# EAGLE design untitled (EAGLE 5.04)
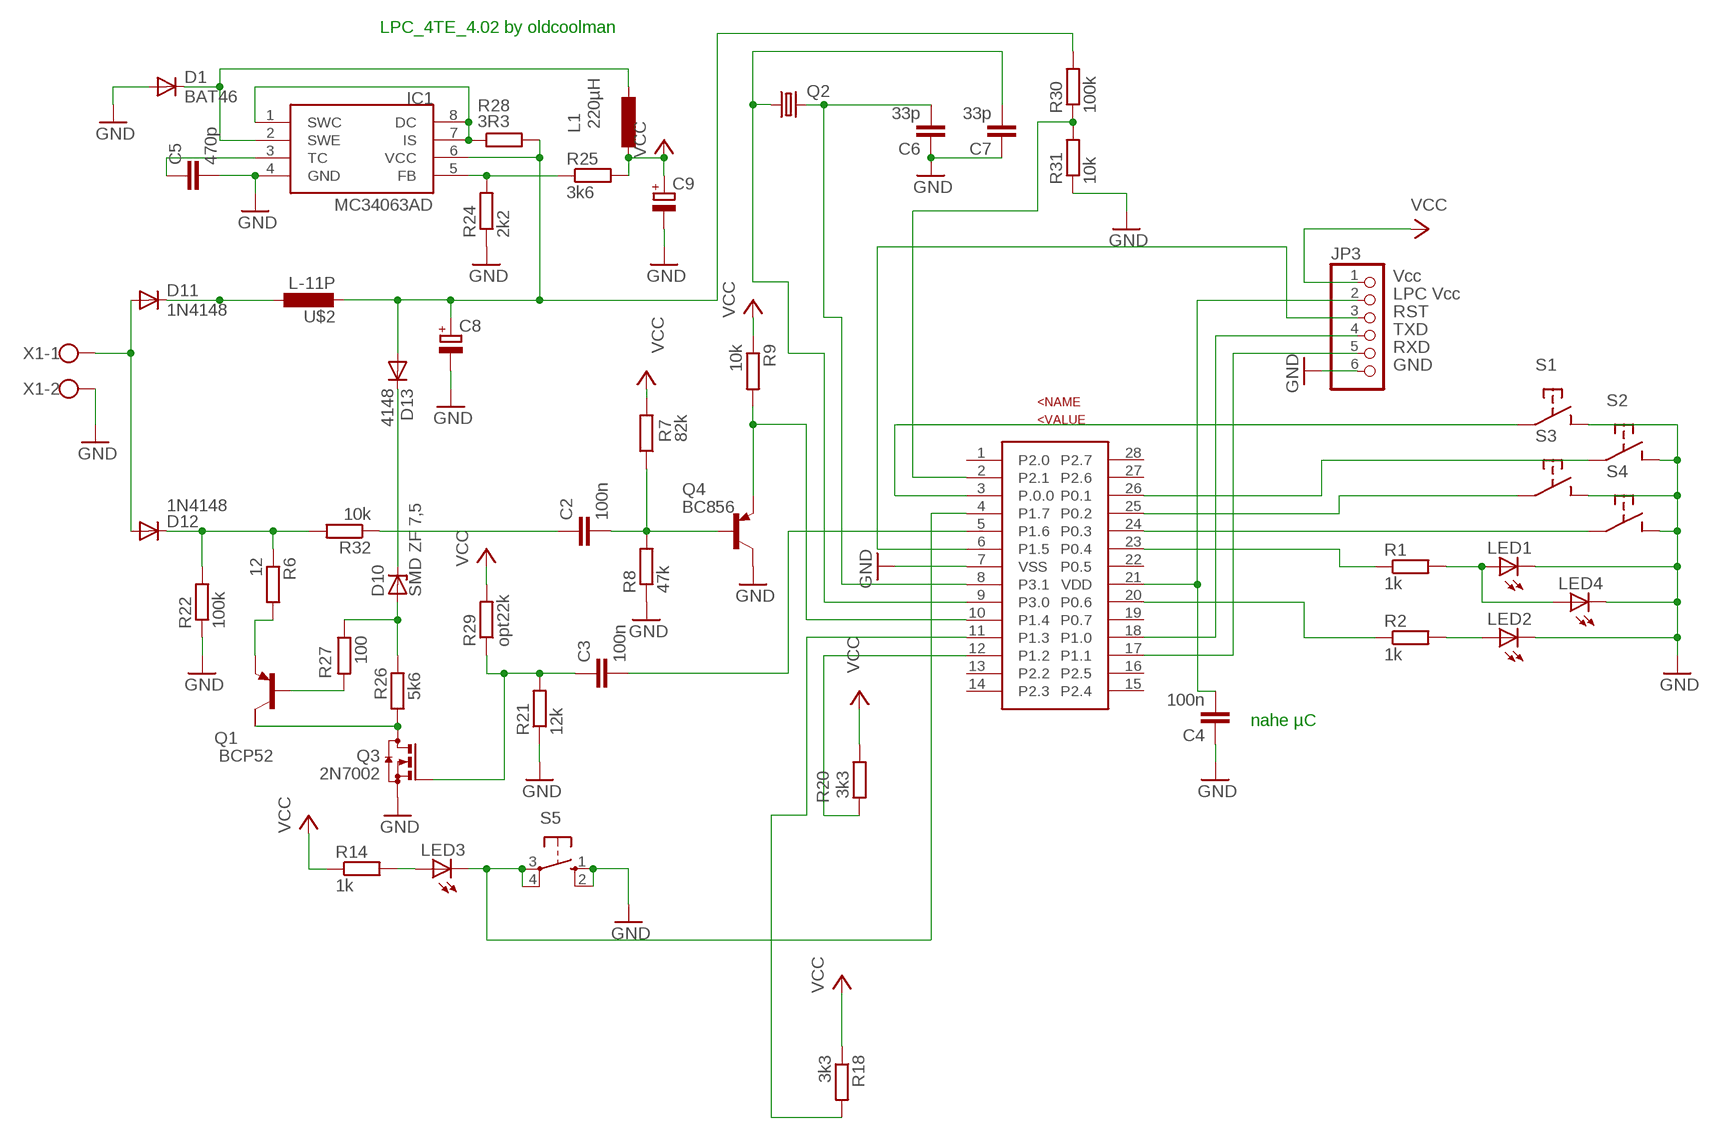
[diagram p0: schematic, sheet 1]

## Parts
C2  100n  C-EUC1206  [C1206]
C3  100n  C-EUC1206  [C1206]
C4  100n  C-EUC1206  [C1206]
C5  470p  C-EUC1206  [C1206]
C6  33p  C-EUC1206  [C1206]
C7  33p  C-EUC1206  [C1206]
C8  CPOL-EUE3.5-8  [E3,5-8]
C9  CPOL-EUE2.5-5  [E2,5-5]
D1  BAT46  DIODE-MINIMELF  [MINIMELF]
D10  SMD ZF 7,5  ZPD  [MINIMELF]
D11  1N4148  DIODE-MINIMELF  [MINIMELF]
D12  1N4148  DIODE-MINIMELF  [MINIMELF]
D13  4148  DIODE-MINIMELF  [MINIMELF]
IC1  MC34063AD  [SOIC8]
JP3  PINHD-1X6  [1X06]
L1  220µH  L-EU2200-11.43  [2200-11.43]
LED1  LED3MM  [LED3MM]
LED2  LED3MM  [LED3MM]
LED3  LED3MM  [LED3MM]
LED4  LED3MM  [LED3MM]
Q1  BCP52  FZT753SMD  [SOT223]
Q2  CRYSTALHC49U-V  [HC49U-V]
Q3  2N7002  BSS123  [SOT23]
Q4  BC856  BC856ALT1SMD  [SOT23-BEC]
R1  1k  R-EU_R1206  [R1206]
R2  1k  R-EU_R1206  [R1206]
R6  12  R-EU_R1206  [R1206]
R7  82k  R-EU_R1206  [R1206]
R8  47k  R-EU_M1206  [M1206]
R9  10k  R-EU_R1206  [R1206]
R14  1k  R-EU_R1206  [R1206]
R18  3k3  R-EU_R1206  [R1206]
R20  3k3  R-EU_M1206  [M1206]
R21  12k  R-EU_R1206  [R1206]
R22  100k  R-EU_M1206  [M1206]
R24  2k2  R-EU_R1206  [R1206]
R25  3k6  R-EU_M1206  [M1206]
R26  5k6  R-EU_M1206  [M1206]
R27  100  R-EU_R1206  [R1206]
R28  3R3  R-EU_M1206  [M1206]
R29  opt22k  R-EU_R1206  [R1206]
R30  100k  R-EU_R1206  [R1206]
R31  10k  R-EU_R1206  [R1206]
R32  10k  R-EU_R1206  [R1206]
S1  3305  [3305]
S2  3305  [3305]
S3  3305  [3305]
S4  3305  [3305]
S5  10-XX  [B3F-10XX]
U$1  LPC936TSSOP28  [TSSOP28]
U$2  L-11P  [11P]
X1  W237-02P  [W237-132]

## Nets
EIB+: D11.A D12.A X1.1
GND: C4.1 C5.2 C6.1 C7.1 C8.- C9.- D1.A IC1.4(GND) JP3.6 LED1.K(C) LED2.K(C) LED4.K(C) Q3.2(S) Q4.C R8.1 R21.1 R22.1 R24.1 R31.1 S1.P$2 S2.P$2 S3.P$2 S4.P$2 S5.1(S) S5.2(S1) U$1.7(VSS) X1.2
N$1: LED1.A LED4.A R1.2
N$2: LED2.A R2.2
N$7: LED3.K(C) S5.3(P) S5.4(P1) U$1.4(P1.7)
N$9: LED3.A R14.2
N$30: Q4.E R9.2 U$1.10(P1.4)
N$31: C2.2 Q4.B R7.1 R8.2
N$33: C3.2 U$1.5(P1.6)
N$34: D12.C R6.1 R22.2 R32.2
N$41: JP3.5 U$1.17(P1.1)
N$42: JP3.3 U$1.6(P1.5)
N$43: JP3.4 U$1.18(P1.0)
N$44: C4.2 JP3.2 U$1.21(VDD)
N$47: R18.2 U$1.11(P1.3)
N$48: C3.1 Q3.1(G) R21.2 R29.1
N$50: IC1.5(FB) R24.2 R25.1
N$51: D1.C IC1.2(SWE) L1.2
N$52: C5.1 IC1.3(TC)
N$53: D11.C U$2.P$1
N$54: Q1.2(C) Q3.3(D) R26.1
N$55: D10.A R26.2 R27.1
N$56: Q1.3(E) R6.2
N$57: Q1.1(B) R27.2
N$58: D10.C D13.C
N$59: C6.2 Q2.2 U$1.8(P3.1)
N$63: IC1.1(SWC) IC1.7(IS) IC1.8(DC) R28.1
N$71: R20.2 U$1.12(P1.2)
N$72: C8.+ D13.A IC1.6(VCC) R28.2 R30.2 U$2.P$2
N$75: R30.1 R31.2 U$1.2(P2.1)
N$76: C7.2 Q2.1 U$1.9(P3.0)
N$77: C2.1 R32.1
P0.0: S1.P$1 U$1.3(P.0.0)
P0.1: S2.P$1 U$1.26(P0.1)
P0.2: S3.P$1 U$1.25(P0.2)
P0.3: S4.P$1 U$1.24(P0.3)
P0.4: R1.1 U$1.23(P0.4)
P0.6: R2.1 U$1.20(P0.6)
VCC: C9.+ JP3.1 L1.1 R7.2 R9.1 R14.1 R18.1 R20.1 R25.2 R29.2
Unconnected: Q1.4(C/) U$1.1(P2.0) U$1.13(P2.2) U$1.14(P2.3) U$1.15(P2.4) U$1.16(P2.5) U$1.19(P0.7) U$1.22(P0.5) U$1.27(P2.6) U$1.28(P2.7)

## Notes on the sheet
- LPC_4TE_4.02 by oldcoolman
- Vcc
- LPC Vcc
- RST
- TXD
- RXD
- GND
- nahe µC

## Library data of the parts
C2-C7 = rcl:C-EU: CAPACITOR, European symbol
C8 C9 = rcl:CPOL-EU: POLARIZED CAPACITOR, European symbol
D1 D11-D13 = diode:DIODE-: DIODE
D10 = diode:ZPD: Z DIODE 500 mW
IC1 = mc34063:MC34063
JP3 = pinhead:PINHD-1X6: PIN HEADER
L1 = rcl:L-EU: INDUCTOR, European symbol
LED1-LED4 = led:LED: LED OSRAM: - CHIPLED LG R971, LG N971, LY N971, LG Q971, LY Q971, LO R971, LY R971 LH N974, LH R974 LS Q976, LO Q976, LY Q976 LO Q996 - Hyper CHIPLED LW Q18S LB Q993, LB Q99A, LB R99A - SideLED LS A670, LO A670, LY A670, LG A670, LP A670 LB A673, LV A673, LT A673, LW A673 LH A674 LY A675 LS A676, LA A676, LO A676, LY A676, LW A676 LS A679, LY A679, LG A679 - Hyper Micro SIDELED® LS Y876, LA Y876, LO Y876, LY Y876 LT Y87S - SmartLED LW L88C, LW L88S LB L89C, LB L89S, LG L890 LS L89K, LO L89K, LY L89K LS L896, LA L896, LO L896, LY L896 - TOPLED LS T670, LO T670, LY T670, LG T670, LP T670 LSG T670, LSP T670, LSY T670, LOP T670, LYG T670 LG T671, LOG T671, LSG T671 LB T673, LV T673, LT T673, LW T673 LH T674 LS T676, LA T676, LO T676, LY T676, LB T676, LH T676, LSB T676, LW T676 LB T67C, LV T67C, LT T67C, LS T67K, LO T67K, LY T67K, LW E67C LS E67B, LA E67B, LO E67B, LY E67B, LB E67C, LV E67C, LT E67C LW T67C LS T679, LY T679, LG T679 LS T770, LO T770, LY T770, LG T770, LP T770 LB T773, LV T773, LT T773, LW T773 LH T774 LS E675, LA E675, LY E675, LS T675 LS T776, LA T776, LO T776, LY T776, LB T776 LHGB T686 LT T68C, LB T68C - Hyper Mini TOPLED® LB M676 - Mini TOPLED Santana® LG M470 LS M47K, LO M47K, LY M47K Source: http://www.osram.convergy.de - LUMILED® LXK2-PW12-R00, LXK2-PW12-S00, LXK2-PW14-U00, LXK2-PW14-V00 LXK2-PM12-R00, LXK2-PM12-S00, LXK2-PM14-U00 LXK2-PE12-Q00, LXK2-PE12-R00, LXK2-PE12-S00, LXK2-PE14-T00, LXK2-PE14-U00 LXK2-PB12-K00, LXK2-PB12-L00, LXK2-PB12-M00, LXK2-PB14-N00, LXK2-PB14-P00, LXK2-PB14-Q00 LXK2-PR12-L00, LXK2-PR12-M00, LXK2-PR14-Q00, LXK2-PR14-R00 LXK2-PD12-Q00, LXK2-PD12-R00, LXK2-PD12-S00 LXK2-PH12-R00, LXK2-PH12-S00 LXK2-PL12-P00, LXK2-PL12-Q00, LXK2-PL12-R00 Source: www.luxeon.com
Q1 = transistor-pnp:FZT753SMD: PNP Transistor
Q2 = crystal:CRYSTAL: CRYSTAL
Q3 = transistor-small-signal:BSS123: N-CHANNEL MOS FET
Q4 = transistor-pnp:BC856*: PNP Transistror
R1 R2 R6-R9 R14 R18 R20-R22 R24-R32 = rcl:R-EU_: RESISTOR, European symbol
S1-S4 = kubi:3305: Taster 3305
S5 = switch-omron:10-XX: OMRON SWITCH
U$1 = freebuslpc:LPC936: C51 Based Microcontroller LPC936 ADC and 16kbyte Flash
U$2 = rcl:L-11P
X1 = con-wago-508:W237-02P: WAGO SREW CLAMP

## Board
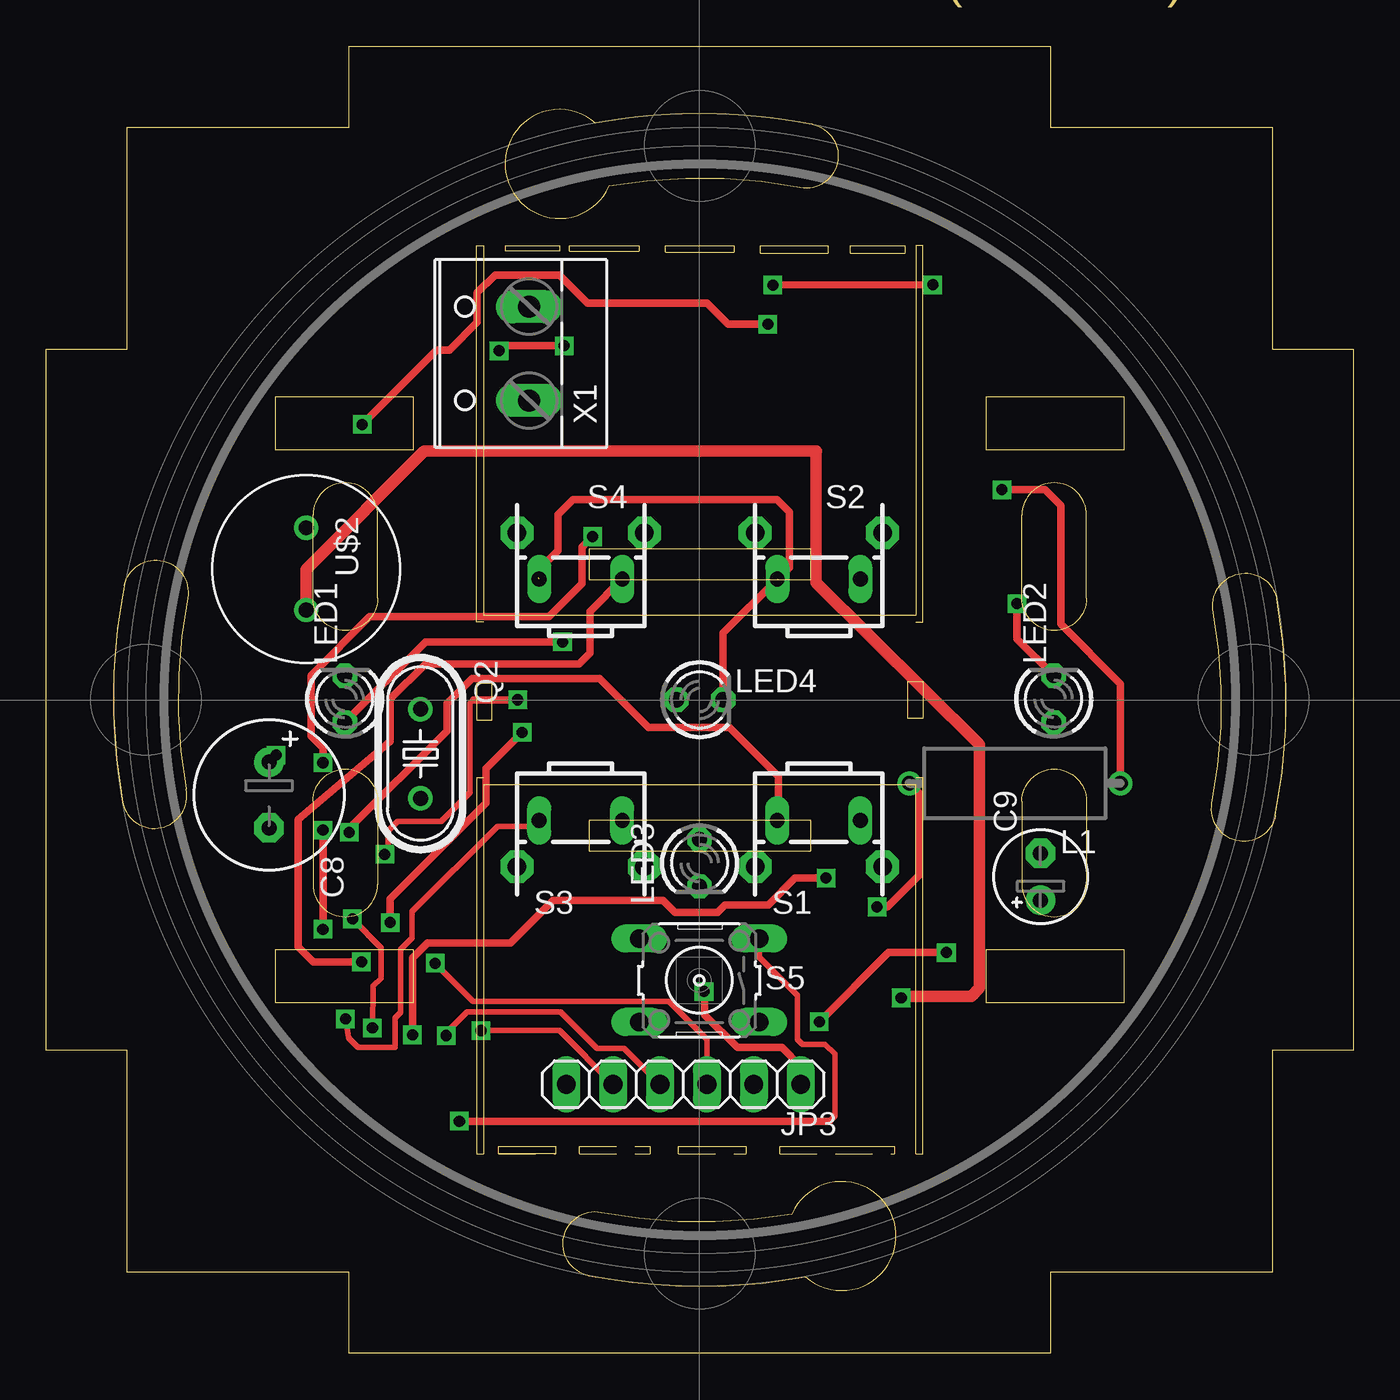
[diagram p1: board, top side]
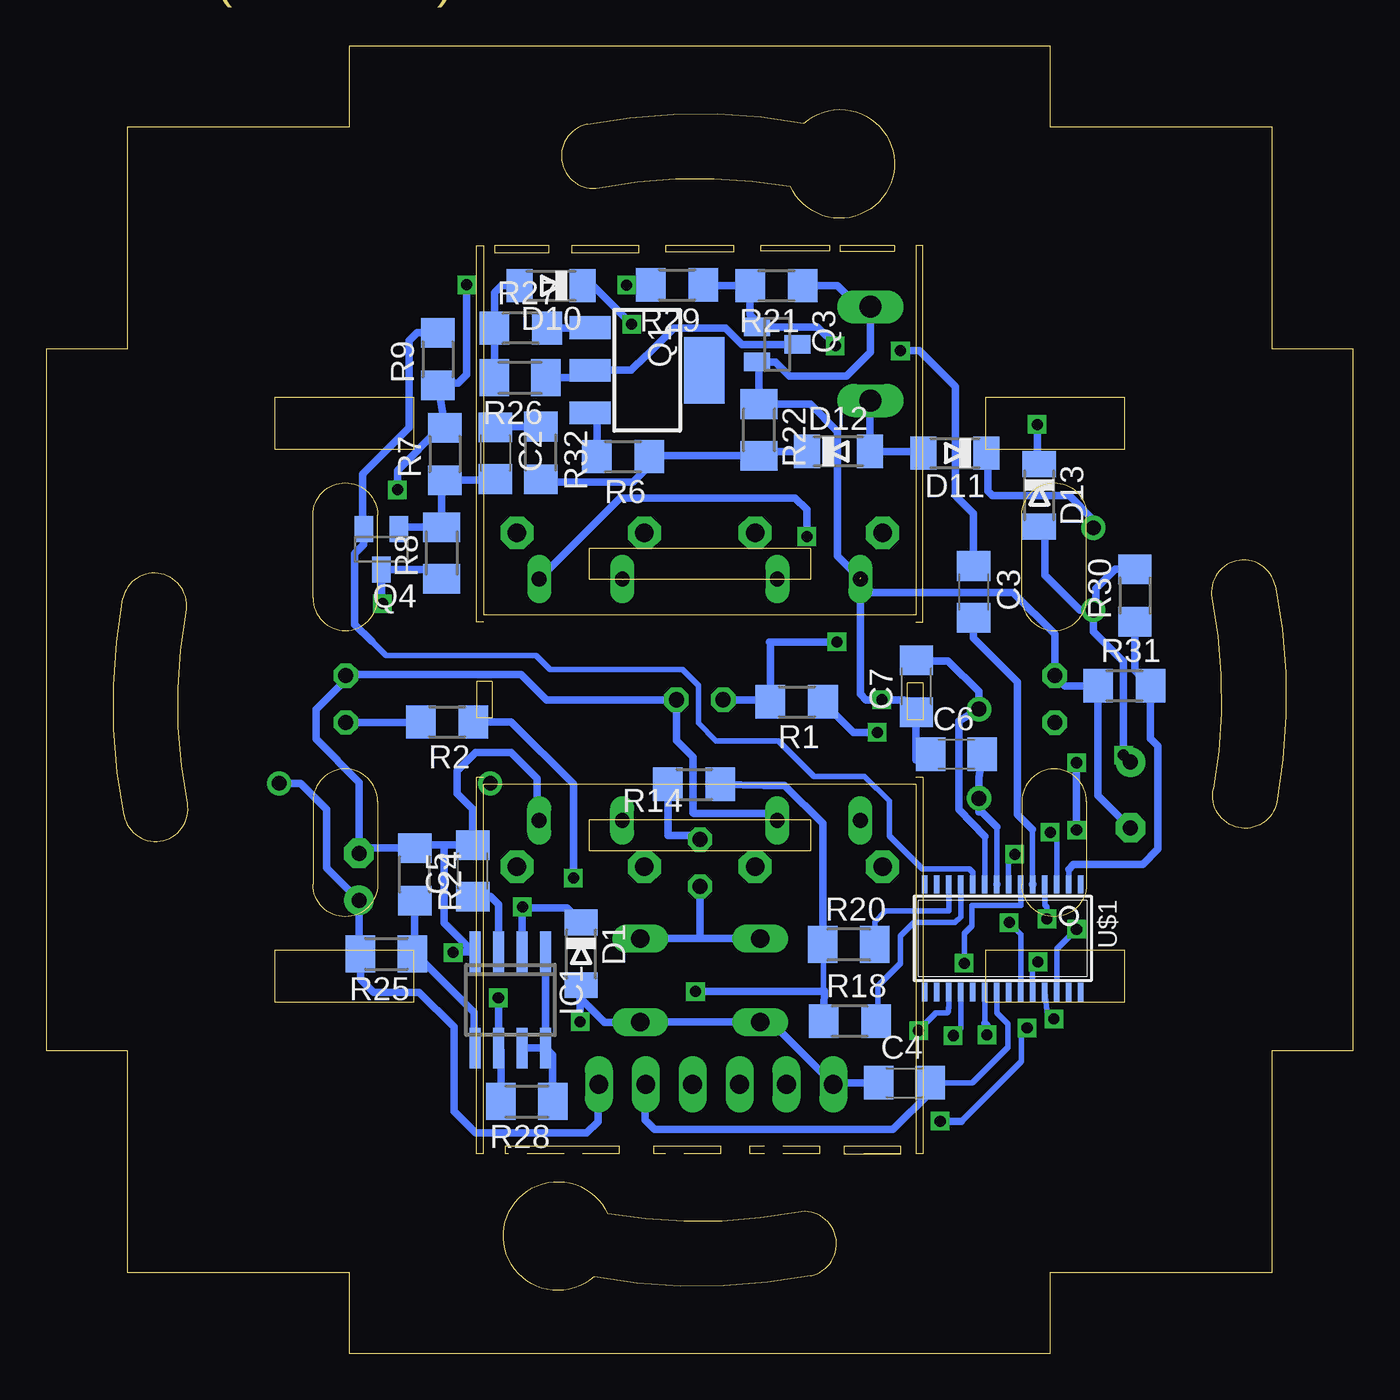
[diagram p2: board, bottom side, seen from below]

Size 70.8 x 70.8 mm. Coordinates in mm from the lower left corner, seen from the top.
Outline: 7.66,40.9 arc179 4.23,41.57 arc21 4.15,29.83 arc180 7.58,30.56 arc-21 7.66,40.9
Outline: 24.5,10.8 27.6,10.8
Outline: 23.7,39.6 23.3,39.6 23.3,60 23.7,60 23.7,40 47.1,40 47.1,60 47.5,60 47.5,39.6 47.1,39.6
Outline: 47.1,31.2 47.5,31.2 47.5,10.8 47.1,10.8 47.1,30.8 23.7,30.8 23.7,10.8 23.3,10.8 23.3,31.2 23.7,31.2
Outline: 24.5,10.8 24.5,11.2 27.6,11.2 27.6,10.8
Outline: 27.6,10.8 24.5,10.8
Outline: 29.75,66.64 arc287 30.49,63.21 arc-21 40.83,63.13 arc179 41.5,66.56 arc21 29.75,66.64
Outline: 41.13,4.14 arc287 40.4,7.57 arc-21 30.06,7.65 arc179 29.38,4.21 arc21 41.13,4.14
Outline: 66.58,29.12 arc-179 63.14,29.8 arc21 63.23,40.14 arc-180 66.66,40.87 arc-21 66.58,29.12
Outline: 16.4,0 16.4,4.4 4.4,4.4 4.4,16.4 0,16.4 0,54.4 4.4,54.4 4.4,66.4 16.4,66.4 16.4,70.8 54.4,70.8 54.4,66.4 66.4,66.4 66.4,54.4 70.8,54.4 70.8,16.4 66.4,16.4 66.4,4.4 54.4,4.4 54.4,0 16.4,0
Outline: 24.15,34.3 24.15,36.3 23.3,36.3 23.3,34.3 24.15,34.3
Outline: 46.65,36.4 46.65,34.4 47.5,34.4 47.5,36.4 46.65,36.4
Outline: 12.4,19 19.9,19 19.9,21.84 12.4,21.84 12.4,19
Outline: 12.4,48.96 19.9,48.96 19.9,51.8 12.4,51.8 12.4,48.96
Outline: 50.9,19 58.4,19 58.4,21.84 50.9,21.84 50.9,19
Outline: 50.9,48.96 58.4,48.96 58.4,51.8 50.9,51.8 50.9,48.96
Outline: 14.45,29.9 14.45,25.4 arc180 17.95,25.4 17.95,29.9 arc180 14.45,29.9
Outline: 52.85,29.9 52.85,25.4 arc180 56.35,25.4 56.35,29.9 arc180 52.85,29.9
Outline: 17.95,40.9 17.95,45.4 arc180 14.45,45.4 14.45,40.9 arc180 17.95,40.9
Outline: 56.35,40.9 56.35,45.4 arc180 52.85,45.4 52.85,40.9 arc180 56.35,40.9
Outline: 28.9,10.8 32.7,10.8 32.7,11.2 28.9,11.2 28.9,10.8
Outline: 34.25,10.8 37.9,10.8 37.9,11.2 34.25,11.2 34.25,10.8
Outline: 39.75,10.8 45.95,10.8 45.95,11.2 39.75,11.2 39.75,10.8
Outline: 29.4,43.6 41.4,43.6 41.4,41.9 29.4,41.9 29.4,43.6
Outline: 29.4,27.2 41.4,27.2 41.4,28.9 29.4,28.9 29.4,27.2
Outline: 27.8,59.7 24.85,59.7 24.85,60 27.8,60 27.8,59.7
Outline: 28.35,59.7 32.1,59.7 32.1,60 28.35,60 28.35,59.7
Outline: 33.55,59.65 37.25,59.65 37.25,60 33.55,60 33.55,59.65
Outline: 38.7,59.6 42.35,59.6 42.35,60 38.7,60 38.7,59.6
Outline: 43.55,59.6 46.5,59.6 46.5,60 43.55,60 43.55,59.6
Copper layers (1*16): Top 0.035mm / dielectric 1.5mm / Bottom 0.035mm
Design rules "default": minimum track width 10mil, minimum drill 24mil, track to track 8mil, track to pad 8mil, pad to pad 8mil, via to via 8mil, smd to smd 8mil, copper to edge 40mil, drill to drill 8mil, minimum pad ring 10mil, minimum via ring 8mil, stop-mask expansion 4mil, vias tented up to drill 0mil, thermal gap 10mil
tKeepout: area 12.2,47.8 to 20.1,51.8; area 50.9,47.8 to 58.4,51.8; area 12.4,19 to 19.9,22.9; area 50.9,19 to 58.4,23

### Footprints (pad centres in the part's own frame; a part is rotated, then mirrored left to right if it is on the bottom)
C1206 = smd 1.6 x 1.8: 1 -1.4,0; 2 1.4,0
E3,5-8 = drill 0.813 pad 1.6 round: + -1.778,0 | drill 0.813 pad 1.6 octagon: - 1.778,0
E2,5-5 = drill 0.813 pad 1.6 round: + -1.27,0 | drill 0.813 pad 1.6 octagon: - 1.27,0
MINIMELF = smd 1.4 x 1.8: A 1.7,0; C -1.7,0
SOIC8 = smd 0.6 x 2.2: 1 -1.905,-2.6; 2 -0.635,-2.6; 3 0.635,-2.6; 4 1.905,-2.6; 5 1.905,2.6; 6 0.635,2.6; 7 -0.635,2.6; 8 -1.905,2.6
1X06 = drill 1.016 long: 1 -6.35,0; 2 -3.81,0; 3 -1.27,0; 4 1.27,0; 5 3.81,0; 6 6.35,0
2200-11.43 = drill 0.8 pad 1.27 round: 1 -5.715,0; 2 5.715,0
LED3MM = drill 0.813 octagon: A -1.27,0; K 1.27,0
SOT223 = smd 1.219 x 2.235: 1 -2.311,-3.099; 2 0,-3.099; 3 2.311,-3.099 | smd 3.6 x 2.2: 4 0,3.099
HC49U-V = drill 0.813 round: 1 -2.413,0; 2 2.413,0
SOT23 = smd 1 x 1.4: 1 -0.95,-1.1; 2 0.95,-1.1; 3 0,1.1
SOT23-BEC = smd 1 x 1.4: B -0.95,-1.1; C 0,1.1; E 0.95,-1.1
R1206 = smd 1.6 x 1.803: 1 -1.422,0; 2 1.422,0
M1206 = smd 1.6 x 2: 1 -1.4,0; 2 1.4,0
3305 = drill 0.8 long: P$1 -2.25,0; P$2 2.25,0 | drill 1 pad 1.778 octagon: P$3 -3.45,-2.5; P$4 3.45,-2.5
B3F-10XX = drill 1.016 long: 1 -3.251,2.261; 2 3.251,2.261; 3 -3.251,-2.261; 4 3.251,-2.261
TSSOP28 = smd 0.305 x 0.991: 1 -4.225,-2.918; 2 -3.575,-2.918; 3 -2.925,-2.918; 4 -2.275,-2.918; 5 -1.625,-2.918; 6 -0.975,-2.918; 7 -0.325,-2.918; 8 0.325,-2.918; 9 0.975,-2.918; 10 1.625,-2.918; 11 2.275,-2.918; 12 2.925,-2.918; 13 3.575,-2.918; 14 4.225,-2.918; 15 4.225,2.918; 16 3.575,2.918; 17 2.925,2.918; 18 2.275,2.918; 19 1.625,2.918; 20 0.975,2.918; 21 0.325,2.918; 22 -0.325,2.918; 23 -0.975,2.918; 24 -1.625,2.918; 25 -2.275,2.918; 26 -2.925,2.918; 27 -3.575,2.918; 28 -4.225,2.918
11P = drill 0.8 round: P$1 -2.223,0; P$2 2.223,0
W237-132 = drill 1.194 long: 1 -2.54,-0.635; 2 2.54,-0.635

### Placement (x,y rotation side)
C2  46.47,48.75 270 bottom
C3  20.57,41.24 270 bottom
C4  24.32,14.66 0 bottom
C5  47.69,26.12 90 bottom
C6  21.5,32.45 0 bottom
C7  23.66,36.13 90 bottom
C8  12.07,30.24 270 top
C9  53.86,25.81 90 top
D1  41.83,21.64 270 bottom
D10  43.46,57.82 180 bottom
D11  21.58,48.76 180 bottom
D12  27.88,48.85 0 bottom
D13  17.01,46.47 270 bottom
IC1  45.65,19.14 180 bottom
JP3  34.52,14.57 180 top
L1  52.46,30.87 180 top
LED1  16.17,35.43 90 top
LED2  54.57,35.44 90 top
LED3  35.39,26.56 270 top
LED4  35.4,35.4 0 top
Q1  38.25,53.24 270 bottom
Q2  20.28,32.48 270 top
Q3  31.21,54.64 270 bottom
Q4  52.64,43.55 180 bottom
R1  30.15,35.29 180 bottom
R2  49.08,34.2 180 bottom
R6  39.55,48.56 180 bottom
R7  49.21,48.71 90 bottom
R8  49.38,43.34 90 bottom
R9  49.58,53.84 90 bottom
R14  35.71,30.82 180 bottom
R18  27.27,17.99 0 bottom
R20  27.33,22.14 0 bottom
R21  31.24,57.83 180 bottom
R22  32.19,50.01 270 bottom
R24  50.83,25.94 270 bottom
R25  52.37,21.64 180 bottom
R26  45.13,52.85 180 bottom
R27  45.09,55.52 0 bottom
R28  44.77,13.64 180 bottom
R29  36.64,57.86 180 bottom
R30  11.83,41.05 90 bottom
R31  12.41,36.15 0 bottom
R32  44.01,48.77 270 bottom
S1  41.85,28.86 0 top
S2  41.85,41.94 180 top
S3  28.95,28.86 0 top
S4  28.95,41.94 180 top
S5  35.37,20.2 180 top
U$1  18.99,22.48 180 bottom
U$2  14.07,42.49 270 top
X1  25.52,54.15 90 top

### Tracks (layer width: path | path; a pad name or v marks a point on that pad's centre or on a via)
EIB+
  Bottom 0.406: X1.1 26.19,51.58 D12.A 23.37,48.85 D11.A
GND  (via drill 0.6)  (2 unrouted)
  Top 0.305: v18.34,27.03 18.51,27.2 18.51,28.29 19.03,28.81 21.4,28.81 22.96,30.37 22.96,35.22 23.14,35.4
  Top 0.406: v48.76,21.71 45.63,21.71 v41.88,17.96 | v52.58,40.6 52.58,38.7 LED2.K | S2.P$2 36.67,39.01 LED4.K | 39.58,41.88 40.27,42.57 40.27,45.56 39.58,46.25 28.55,46.25 27.72,45.42 27.72,43.48 26.68,42.44 26.68,42.02 | v25.54,35.4 23.14,35.4
  Bottom 0.305: U$1.7 18.68,25.41 18.68,26.78 18.43,27.03 v18.34,27.03
  Bottom 0.406: 26.98,56.85 26.82,56.69 X1.2 26.16,54.23 27.46,52.93 30.53,52.93 31.29,53.69 Q3.2 32.19,53.58 R22.1 29.41,51.41 27.93,49.93 27.93,43.17 S4.P$2 26.7,41.41 | 26.98,56.85 27.95,57.82 R21.1 | 26.98,56.85 27.28,56.56 | LED2.K 54.81,36.95 | LED2.K 54.57,36.48 56.18,34.87 56.18,33.27 53.84,30.93 53.84,27.1 C9.- 53.58,27.36 R24.1 50.67,27.52 49.21,27.52 | 49.21,27.52 C5.2 47.69,29.47 48.54,30.32 48.54,31.54 47.54,32.54 45.61,32.54 44.2,31.13 44.2,28.96 S1.P$2 | 49.21,27.52 49.24,27.49 49.24,23.31 47.67,21.74 IC1.4 48.73,21.74 v48.76,21.71 | LED2.K 54.5,36.78 45.07,36.78 43.69,35.4 LED4.K 36.67,33.2 35.76,32.29 35.76,29.28 35.71,29.23 31.57,29.23 S3.P$2 | C8.- 13.83,30.22 R31.1 15.62,36.15 LED1.K 16.17,38.95 18.44,41.22 26.51,41.22 26.7,41.41 | C4.1 28.08,14.66 JP3.6 31.53,17.94 S5.2 S5.1 38.63,17.93 40.55,17.93 41.83,19.21 D1.A 41.88,19.88 v41.88,17.96 | C7.1 23.69,34.7 23.69,32.13 C6.1 | C7.1 23.7,34.76 | R8.1 49.89,42.45 Q4.C 52.64,40.66 v52.58,40.6 | 26.7,41.41 26.7,35.71 26.39,35.4 v25.54,35.4 24.34,35.4 C7.1
N$1  (via drill 0.6)
  Top 0.406: LED1.A 20.54,38.53 v27.97,38.53
  Bottom 0.406: v27.97,38.53 31.62,38.53 31.57,38.48 R1.2 31.68,35.4 LED4.A
N$2
  Bottom 0.406: LED2.A 50.53,34.17 R2.2
N$7  (via drill 0.6)
  Top 0.305: 42.42,12.57 42.71,12.86 42.71,16.21 42.19,16.73 40.97,16.73 40.69,17.01 40.69,19.39 38.62,21.46 S5.3 | v16.59,23.53 18.15,21.97 18.15,20.3 17.71,19.89 v17.67,17.62
  Top 0.406: v22.38,12.57 42.42,12.57
  Bottom 0.305: U$1.4 16.71,24.3 16.59,24.18 v16.59,23.53 | v17.67,17.62 17.98,17.43 17.98,15.82 21.23,12.57
  Bottom 0.406: 35.43,22.46 S5.4 | S5.3 35.43,22.46 | LED3.K 35.39,22.5 35.43,22.46 | v22.38,12.57 21.23,12.57
N$9
  Bottom 0.406: LED3.A 35.6,28.04 37.11,28.04 37.13,28.06 R14.2
N$30
  Bottom 0.305: U$1.10 20.61,26.04 20.8,26.23 23.33,26.23 25.13,28.03 25.13,29.91 26.47,31.25 29.21,31.25 31.14,33.18 34.51,33.18 35.47,34.14 35.47,36.16 36.34,37.03 43.5,37.03 44.27,37.8 52.4,37.8 53.17,38.57
  Bottom 0.406: R9.2 49.29,55.29 50.71,55.29 51.15,54.85 51.15,50.13 53.66,47.62 53.66,44.72 Q4.E 53.59,43.8 54.08,43.31 54.08,39.48 53.17,38.57
N$31
  Bottom 0.406: R7.1 49.74,46.76 | R7.1 46.54,47.29 C2.2 | R7.1 49.38,47.12 R8.2 51.6,44.74 Q4.B
N$33
  Bottom 0.305: 17.38,25.41 17.38,28.37
  Bottom 0.406: C3.2 20.57,38.73 18.2,36.36 18.2,29.19 17.38,28.37 | U$1.5 17.38,25.41
N$34
  Bottom 0.406: D12.C 31.95,48.85 R22.2 38.08,48.61 R6.1 38.13,48.08 39.02,47.19 43.85,47.19 R32.2
N$41  (via drill 0.6)
  Top 0.305: v23.55,17.48 27.8,17.48 JP3.5
  Bottom 0.305: U$1.17 21.91,18.75 21.94,18.72 21.94,18.51 22.02,18.43 22.6,18.43 v23.55,17.48
N$42  (via drill 0.6)
  Top 0.305: JP3.3 35.79,17.01 33.73,19.07 23.13,19.07 v21.07,21.13
  Bottom 0.305: 21.1,21.11 v21.07,21.13 21.07,22.75 20.67,23.15 20.67,24.24 20.65,24.26 18.02,24.26 18.01,24.25 U$1.6
N$43  (via drill 0.6)
  Top 0.305: v21.67,17.21 21.67,17.37 22.79,18.49 27.87,18.49 29.83,16.53 31.29,16.53 JP3.4
  Bottom 0.305: U$1.18 21.26,17.62 v21.67,17.21
N$44
  Bottom 0.305: U$1.21 19.31,18.45 18.71,17.85 18.71,16.56 20.63,14.64 22.23,14.64 22.24,14.66
  Bottom 0.406: JP3.2 38.37,14.53 38.37,12.65 37.84,12.12 24.94,12.12 22.92,14.14 C4.2 22.24,14.66
N$47
  Bottom 0.305: U$1.11 21.26,23.65 21.57,23.34 23.81,23.34 24.54,22.61 24.54,21.11 25.75,19.9 25.75,18.09 R18.2
N$48  (via drill 0.6)
  Top 0.406: v28.06,54.57 24.8,54.57 v24.53,54.3
  Bottom 0.406: R29.1 35.18,57.83 R21.2 32.69,57.8 32.69,56.25 32.31,55.87 Q3.1 29.02,55.59 28,54.57 v28.06,54.57 | v24.53,54.3 23.49,54.3 21.55,52.36 21.55,46.46 20.58,45.49 C3.1
N$50
  Bottom 0.406: R24.2 50.83,21.78 R25.1 50.79,21.64 47.62,18.47 47.62,16.6 IC1.5
N$51  (via drill 0.6)
  Top 0.406: v45,24.18 45.57,24.18 47.3,25.91 47.3,30.32 L1.2
  Bottom 0.406: IC1.2 45.02,24.16 v45,24.18 44.95,24.13 42.59,24.13 41.83,23.37 D1.C
N$52
  Bottom 0.406: IC1.3 46.29,24.31 46.73,24.75 47.67,24.75 C5.1
N$53
  Bottom 0.406: U$2.P$1 14.07,45.13 15.39,46.45 19.55,46.45 19.8,46.7 19.8,48.68 D11.C
N$54
  Bottom 0.406: Q3.3 33.12,54.64 34,55.52 36.8,55.52 38.27,54.05 38.31,54.05 39.11,53.25 40.97,53.25 Q1.2 41.74,52.85 R26.1
N$55
  Bottom 0.406: R26.2 46.52,52.87 R27.1 46.51,57.46 46.15,57.82 D10.A
N$56
  Bottom 0.406: R6.2 40.98,50.56 Q1.3
N$57
  Bottom 0.406: R27.2 41.38,55.52 Q1.1
N$58  (via drill 0.6)
  Top 0.406: v39.09,55.74 36.93,55.74 35.78,56.89 29.32,56.89 27.8,58.41 24.31,58.41 23.35,57.45 23.35,55.86 21.84,54.35 21.16,54.35 v17.12,50.31
  Bottom 0.406: D10.C 41.17,57.82 v39.09,55.74 | v17.12,50.31 17.12,48.28 D13.C
N$59
  Bottom 0.305: 19.3,25.41 19.3,28.51
  Bottom 0.406: 19.3,28.51 20.28,29.49 Q2.2 20.29,29.31 20.29,31.16 C6.2 | U$1.8 19.3,25.41
N$63
  Bottom 0.406: R28.1 43.37,16.16 IC1.8 | IC1.8 IC1.7 | IC1.8 IC1.1
N$71
  Bottom 0.305: U$1.12 21.91,24 21.94,23.97 25.33,23.97 25.92,23.38 25.92,22.15 R20.2
N$72  (via drill 0.6)
  Top 0.61: v46.31,19.25 46.39,19.33 50.1,19.33 50.56,19.79 50.56,32.97 41.7,41.75 41.7,48.81 41.73,48.86 20.47,48.86 14.07,42.46 U$2.P$2
  Bottom 0.406: U$2.P$2 14.82,40.26 16.72,42.16 16.72,44.48 D13.A | R30.2 12.89,42.48 13.95,41.41 13.95,40.39 U$2.P$2 | U$2.P$2 14.07,39.1 12.45,37.48 v12.45,32.4 C8.+ | R28.2 46.17,16.42 IC1.6 46.29,19.23 v46.31,19.25
N$75
  Bottom 0.305: 15.42,26.22 U$1.2
  Bottom 0.406: R30.1 11.83,37 R31.2 10.98,33.3 10.58,32.9 10.58,27.31 11.41,26.48 15.16,26.48 15.42,26.22
N$76
  Bottom 0.305: U$1.9 19.96,27.98
  Bottom 0.406: C7.2 23.65,37.51 21.95,37.51 20.28,35.84 Q2.1 21.37,34.26 21.37,29.45 19.96,27.98
N$77
  Bottom 0.406: R32.1 46.43,50.19 C2.1
P0.0  (via drill 0.6)
  Top 0.406: S1.P$1 39.66,28.92 39.66,31.25 37.01,33.9 32.63,33.9 29.98,36.55 23.06,36.55 21.71,35.2 21.71,33.71 16.42,28.42 v16.42,28.22
  Bottom 0.305: v16.42,28.22 16.06,27.86 U$1.3
P0.1  (via drill 0.6)
  Top 0.406: v29.6,44.24 29.02,43.66 29.02,41.69 27.23,39.9 17.53,39.9 14.35,36.72 14.35,33.43 14.99,32.79 v14.99,31.99 | v14.99,22.97 v14.99,28.34
  Bottom 0.305: v14.99,22.97 16.06,21.9 U$1.26
  Bottom 0.406: S2.P$1 39.72,46.32 30.23,46.32 29.6,45.69 v29.6,44.24 | v14.99,28.34 v14.99,31.99
P0.2  (via drill 0.6)
  Top 0.305: S3.P$1 26.39,28.55 24.45,28.55 19.83,23.93 19.83,22.5 19.2,21.87 19.2,18.46 18.9,18.16 18.9,16.56 16.9,16.58 16.38,17.09 v16.21,18.11
  Bottom 0.305: v16.21,18.11 16.55,18.08 U$1.25
P0.3  (via drill 0.6)
  Top 0.406: S4.P$1 29.45,40.19 29.45,37.93 28.87,37.33 20.56,37.33 18.64,35.43 18.64,33.14 13.64,28.91 13.64,22 14.45,21.2 v17.08,21.2
  Bottom 0.305: U$1.24 17.38,19.54 17.38,20.64 17.39,20.82 v17.08,21.2
P0.4  (via drill 0.6)
  Top 0.406: v25.78,33.63 23.84,31.69 23.84,29.82 18.64,24.62 v18.64,23.33
  Bottom 0.305: v18.64,23.33 18.01,22.7 U$1.23
  Bottom 0.406: R1.1 27.07,33.63 v25.78,33.63
P0.6  (via drill 0.6)
  Top 0.406: v42.24,25.74 40.57,25.74 39.13,24.3 36.76,24.3 36.35,23.89 34.05,23.89 33.41,24.53 27.46,24.53 25.15,22.22 20.65,22.22 19.84,21.41 v19.84,17.25
  Bottom 0.305: 19.95,17.88 19.95,19.55 U$1.20
  Bottom 0.406: R2.1 45.61,34.2 42.24,30.83 v42.24,25.74 | v19.84,17.25 19.84,17.77 19.95,17.88
VCC  (via drill 0.6)
  Top 0.406: v48.02,57.88 v39.36,57.86 | v51.77,46.78 54.08,46.78 54.95,45.91 54.95,39.49 58.18,36.26 L1.1 | v35.63,19.6 35.67,19.56 35.67,18.33 37.44,16.56 39.84,16.56 40.87,15.53 JP3.1
  Bottom 0.305: R18.1 28.7,22.11 R20.1
  Bottom 0.406: L1.1 57.02,30.87 55.61,29.46 55.61,26.29 C9.+ 53.86,21.73 R25.2 53.77,20.26 53.07,19.56 50.59,19.56 48.7,17.67 48.7,13.1 47.54,11.94 41.52,11.94 40.92,12.54 40.92,14.52 JP3.1 | R29.2 39.28,57.86 v39.36,57.86 | v48.02,57.88 48.02,53.02 48.48,52.56 49.17,52.56 R9.1 49.18,50.15 R7.2 49.46,50.13 51.77,47.82 v51.77,46.78 | R18.1 28.65,19.63 28.68,19.6 v35.63,19.6 | R14.1 31.92,30.77 30.81,30.77 28.73,28.69 R20.1

### Text on the board
Dimension: Material Edelstahl 0,8mm | Einheit ist mm Aussenmasse (70.8x70.8)